# Altium schematic sheet PF5b_Filter2A.SchDoc
size A
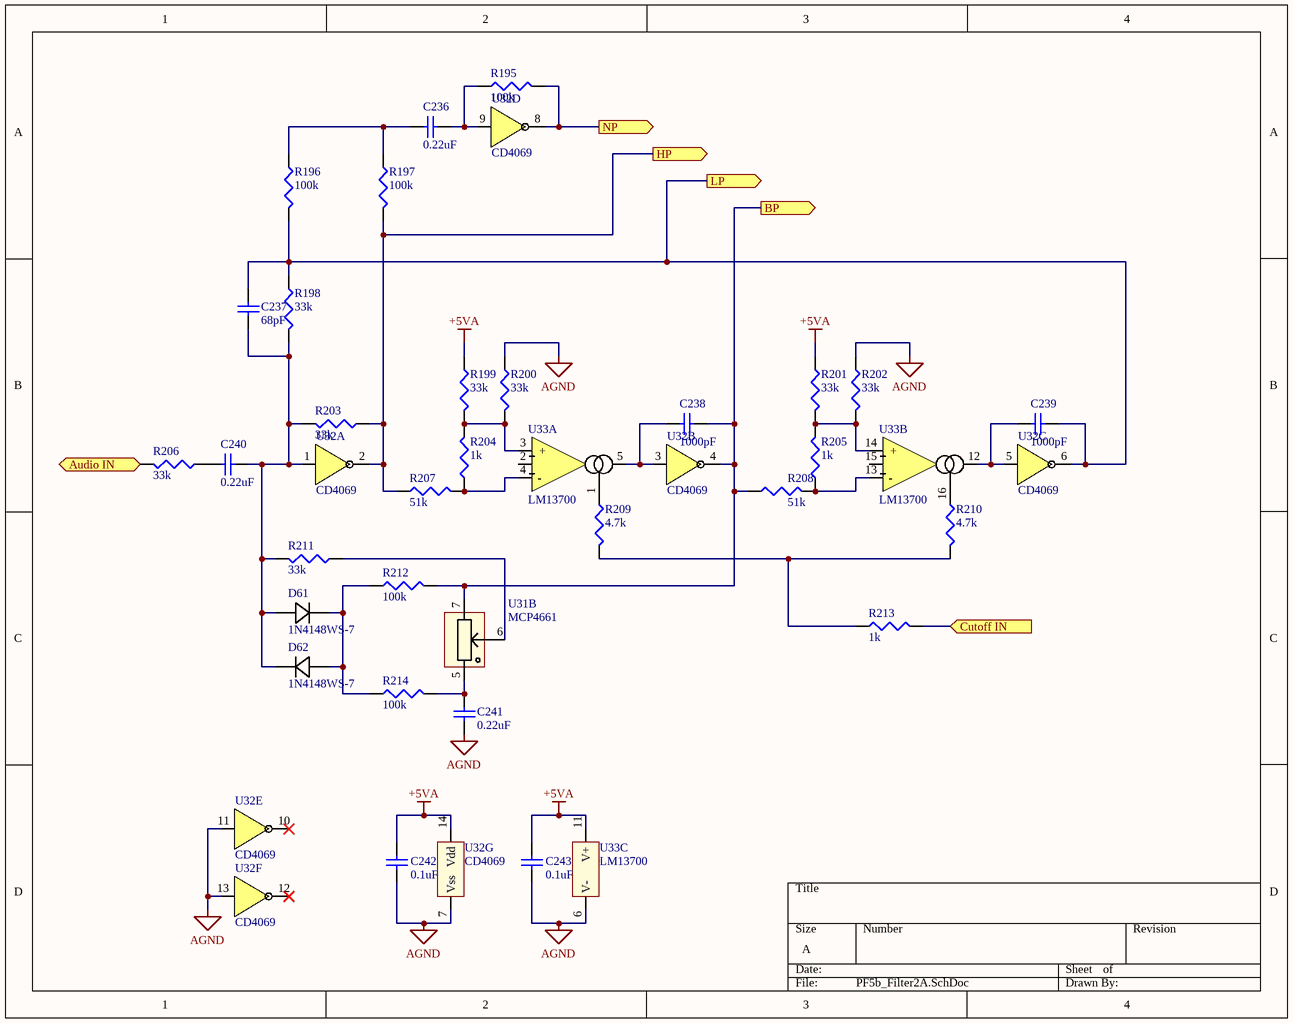
[diagram p0: PF5b_Filter2A.SchDoc]

## Parts
C236  0.22uF  [CAPC1608X08]
C237  68pF  [CAPC1608X08]
C238  1000pF  [CAPC1608X08]
C239  1000pF  [CAPC1608X08]
C240  0.22uF  [CAPC1608X08]
C241  0.22uF  [CAPC1608X08]
C242  0.1uF  [CAPC1608X08]
C243  0.1uF  [CAPC1608X08]
D61  1N4148WS-7  [SOD323-M]
D62  1N4148WS-7  [SOD323-M]
R195  100k  [RESC1608X05]
R196  100k  [RESC1608X05]
R197  100k  [RESC1608X05]
R198  33k  [RESC1608X05]
R199  33k  [RESC1608X05]
R200  33k  [RESC1608X05]
R201  33k  [RESC1608X05]
R202  33k  [RESC1608X05]
R203  33k  [RESC1608X05]
R204  1k  [RESC1608X05]
R205  1k  [RESC1608X05]
R206  33k  [RESC1608X05]
R207  51k  [RESC1608X05]
R208  51k  [RESC1608X05]
R209  4.7k  [RESC1608X05]
R210  4.7k  [RESC1608X05]
R211  33k  [RESC1608X05]
R212  100k  [RESC1608X05]
R213  1k  [RESC1608X05]
R214  100k  [RESC1608X05]
U31  MCP4661  [TSSOP14_MC-M]  (part B of 4)
U32  CD4069  [D14-M]  (parts A,B,C,D,E,F,G of 7)
U33  LM13700  [SO16NB]  (parts A,B,C of 3)

## Ports
Audio IN (in), BP (out), Cutoff IN (in), HP (out), LP (out), NP (out)

## Nets
+5VA: C242.1 C243.1 R199.1 R201.1 U32.14(Vdd) U33.11(V+)
AGND: C241.1 C242.2 C243.2 R200.1 R202.1 U32.7(Vss) U32.11(E) U32.13(F) U33.6(V-)
Audio IN: R206.2 ; port Audio IN
BP: C238.2 R208.1 R212.2 U31.7(P1A) U32.4(~{B}) ; port BP
Cutoff IN: R213.2 ; port Cutoff IN
HP: R197.2 R203.1 R207.1 U32.2(~{A}) ; port HP
LP: C237.2 C239.2 R196.2 R198.1 U32.6(~{C}) ; port LP
NP: R195.2 U32.8(~{D}) ; port NP
NetC236_1: C236.1 R196.1 R197.1
NetC236_2: C236.2 R195.1 U32.9(D)
NetC237_1: C237.1 C240.2 D61.2 D62.1 R198.2 R203.2 R211.2 U32.1(A)
NetC238_1: C238.1 U32.3(B) U33.5(OUT)
NetC239_1: C239.1 U32.5(C) U33.12(OUT)
NetC240_1: C240.1 R206.1
NetC241_2: C241.2 R214.2 U31.5(P1B)
NetD61_1: D61.1 D62.2 R212.1 R214.1
NetR199_2: R199.2 R200.2 R204.2 U33.3(+)
NetR201_2: R201.2 R202.2 R205.2 U33.14(+)
NetR204_1: R204.1 R207.2 U33.4(-)
NetR205_1: R205.1 R208.2 U33.13(-)
NetR209_1: R209.1 U33.1(BIAS)
NetR209_2: R209.2 R210.2 R213.1
NetR210_1: R210.1 U33.16(BIAS)
NetR211_1: R211.1 U31.6(P1W)

Not connected (* = marked no-connect by the designer): U32 10(~{E})* 12(~{F})*; U33 2(Diode_BIAS) 15(Diode_BIAS)

## Library data of the parts
C236 C240 C241 = Cap Semi: Capacitor (Semiconductor SIM Model); Fabricant: MURATA; Fournisseur: Farnell; RefFabricant: GRM188R71A224KA01D; RefFournisseur: 2695909; Value: 0.22uF; Case: 0603 [1608 Metric]; DataSheet: http://www.farnell.com/datasheets/2048635.pdf
C237 = Cap Semi: Capacitor (Semiconductor SIM Model); Fabricant: MURATA; Fournisseur: Farnell; RefFabricant: GRT1885C1H680JA02D; RefFournisseur: 2672146; Value: 68pF; Case: 0603 [1608 Metric]; DataSheet: http://www.farnell.com/datasheets/2165946.pdf
C238 C239 = Cap Semi: Capacitor (Semiconductor SIM Model); Fabricant: MURATA; Fournisseur: Farnell; RefFabricant: GRT1885C1H102JA02D; RefFournisseur: 2672134; Value: 1000pF; Case: 0603 [1608 Metric]; DataSheet: http://www.farnell.com/datasheets/2165937.pdf
C242 C243 = Cap Semi: Capacitor (Semiconductor SIM Model); Fabricant: MURATA; Fournisseur: Farnell; RefFabricant: GRM188F51E104ZA01D; RefFournisseur: 2821272; Value: 0.1uF; Case: 0603 [1608 Metric]; DataSheet: http://www.farnell.com/datasheets/2048672.pdf
D61 D62 = 1N4148WS-7: Diode signaux faibles; Fabricant: ON SEMICONDUCTOR; Fournisseur: Farnell; RefFournisseur: 2453269; DataSheet: http://www.farnell.com/datasheets/2288055.pdf; RefFabricant: 1N4148WS
R195-R197 R212 R214 = Res3: Resistor; Fabricant: TE CONNECTIVITY; Fournisseur: Farnell; RefFabricant: RN73C1J100KBTDF; RefFournisseur: 2687850; Value: 100k; Case: 0603 [1608 Metric]; DataSheet: http://www.farnell.com/datasheets/2189072.pdf
R198-R203 R206 R211 = Res3: Resistor; Fabricant: TE CONNECTIVITY; Fournisseur: Farnell; RefFabricant: CPF-A-0603B33KE1; RefFournisseur: 2483920; Value: 33k; Case: 0603 [1608 Metric]
R204 R205 R213 = Res3: Resistor; Fabricant: TE CONNECTIVITY; Fournisseur: Farnell; RefFabricant: CPF-A-0603B1K0E1; RefFournisseur: 2483880; Value: 1k; Case: 0603 [1608 Metric]; DataSheet: http://www.farnell.com/datasheets/1935020.pdf
R207 R208 = Res3: Resistor; Fabricant: TE CONNECTIVITY; Fournisseur: Farnell; RefFabricant: CPF0603B51KE1; RefFournisseur: 2331265; Value: 51k; Case: 0603 [1608 Metric]; DataSheet: http://www.farnell.com/datasheets/2043335.pdf
R209 R210 = Res3: Resistor; Fabricant: TE CONNECTIVITY; Fournisseur: Farnell; RefFabricant: CPF-A-0603B4K7E1; RefFournisseur: 2483933; Value: 4.7k; Case: 0603 [1608 Metric]; DataSheet: http://www.farnell.com/datasheets/1935020.pdf
U31 = MCP4661: Dual DigiPot non volatile I2C; RefFournisseur: 1840724; RefFabricant: MCP4661-503E/ST; Fournisseur: Farnell; Fabricant: MICROCHIP; DataSheet: http://www.farnell.com/datasheets/2243913.pdf
U32 = CD4069: Hex Inverter; Fabricant: TEXAS INSTRUMENTS; Fournisseur: Farnell; RefFabricant: CD4069UBM; RefFournisseur: 1607751; DataSheet: http://www.ti.com/lit/ds/symlink/cd4069ub.pdf
U33 = LM13700M: Dual Transconductance OpAmp; Fabricant: TEXAS INSTRUMENTS; Fournisseur: Farnell; RefFabricant: LM13700M/NOPB; RefFournisseur: 1468910; DataSheet: http://www.ti.com/lit/ds/symlink/lm13700.pdf